# EAGLE design placa_v22 (EAGLE 6.2)
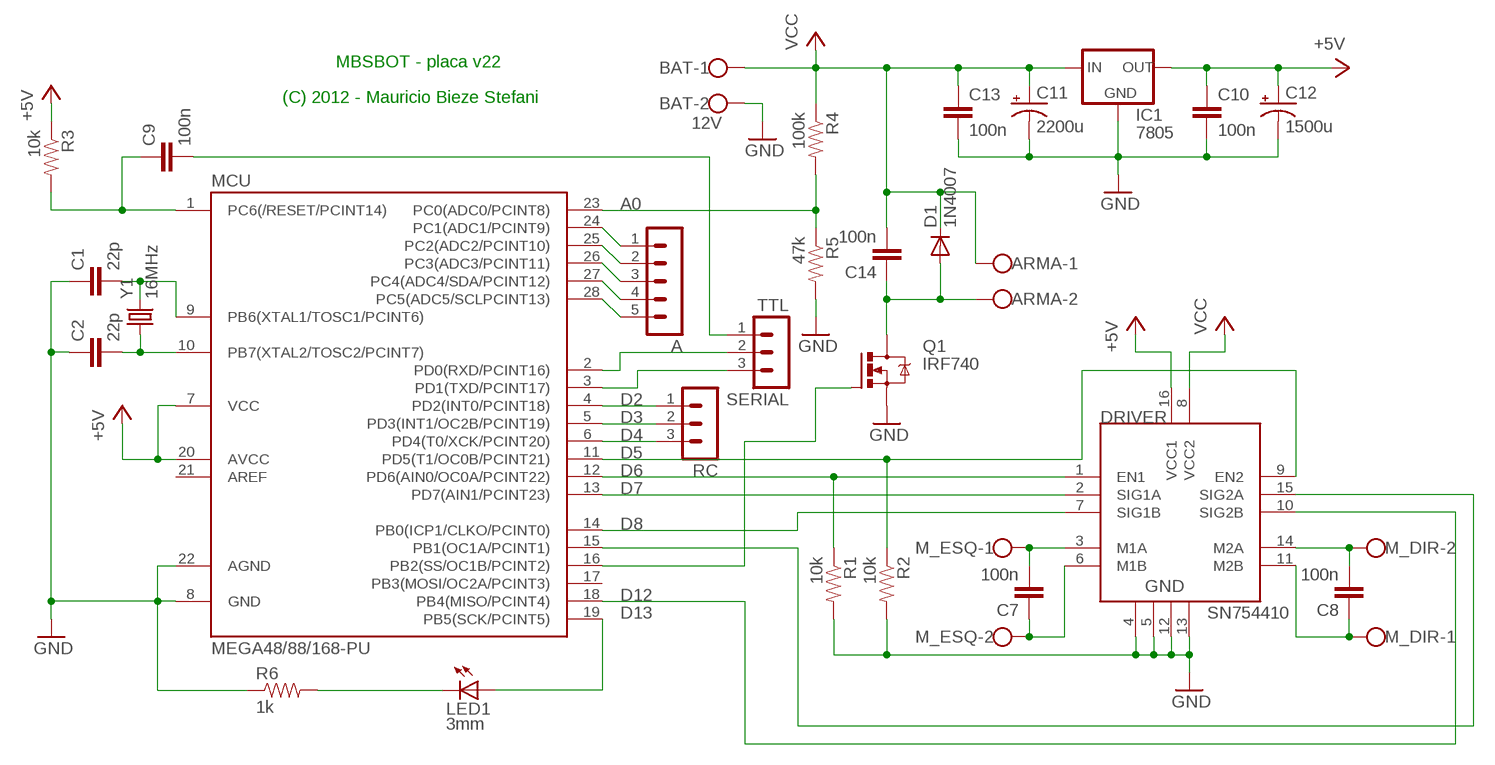
[diagram p0: schematic, sheet 1]

## Parts
A  MA05-1  [MA05-1]
ARMA  W237-102  [W237-102]
BAT  12V  W237-102  [W237-102]
C1  22p  CAPKIT  [CAP-PTH-SMALL-KIT]
C2  22p  CAPKIT  [CAP-PTH-SMALL-KIT]
C7  100n  CAPPTH1  [CAP-PTH-5MM]
C8  100n  CAPPTH1  [CAP-PTH-5MM]
C9  100n  CAPPTH1  [CAP-PTH-5MM]
C10  100n  CAPPTH1  [CAP-PTH-5MM]
C11  2200u  CAP_POLPTH1  [CPOL-RADIAL-100UF-25V]
C12  1500u  CAP_POLPTH1  [CPOL-RADIAL-100UF-25V]
C13  100n  CAPPTH1  [CAP-PTH-5MM]
C14  100n  CAPPTH1  [CAP-PTH-5MM]
D1  1N4007  DIODEPTH  [DIODE-1N4001]
DRIVER  SN754410  [DIP16]
IC1  7805  78XXS  [78XXS]
LED1  3mm  LED3MM  [LED3MM]
M_DIR  W237-102  [W237-102]
M_ESQ  W237-102  [W237-102]
MCU  MEGA48/88/168-PU  [DIL28-3]
Q1  IRF740  [TO220BV]
R1  10k  RESISTORPTH-1/2W  [AXIAL-0.5]
R2  10k  RESISTORPTH-1/2W  [AXIAL-0.5]
R3  10k  RESISTORPTH-1/2W  [AXIAL-0.5]
R4  100k  RESISTORPTH-1/2W  [AXIAL-0.5]
R5  47k  RESISTORPTH-1/2W  [AXIAL-0.5]
R6  1k  RESISTORKIT  [AXIAL-0.3-KIT]
RC  MA03-1  [MA03-1]
SERIAL  TTL  MA03-1  [MA03-1]
Y1  16MHz  CRYSTALHC49US  [HC49US]

## Nets
+5V: C10.1 C12.1(+) DRIVER.16(VCC1) IC1.OUT MCU.7(VCC) MCU.20(AVCC) R3.P$1
A: MCU.2(PD0(RXD/PCINT16)) SERIAL.2
A0: MCU.23(PC0(ADC0/PCINT8)) R4.P$2 R5.P$1
D2: MCU.4(PD2(INT0/PCINT18)) RC.1
D3: MCU.5(PD3(INT1/OC2B/PCINT19)) RC.2
D4: MCU.6(PD4(T0/XCK/PCINT20)) RC.3
D5: DRIVER.9(EN2) MCU.11(PD5(T1/OC0B/PCINT21)) R2.P$1
D6: DRIVER.1(EN1) MCU.12(PD6(AIN0/OC0A/PCINT22)) R1.P$1
D7: DRIVER.2(SIG1A) MCU.13(PD7(AIN1/PCINT23))
D8: DRIVER.7(SIG1B) MCU.14(PB0(ICP1/CLKO/PCINT0))
D12: DRIVER.10(SIG2B) MCU.18(PB4(MISO/PCINT4))
D13: LED1.A MCU.19(PB5(SCK/PCINT5))
GND: BAT.2 C1.1 C2.1 C10.2 C11.2(-) C12.2(-) C13.2 DRIVER.4 DRIVER.5 DRIVER.12 DRIVER.13 IC1.GND MCU.8(GND) MCU.22(AGND) Q1.S R1.P$2 R2.P$2 R5.P$2 R6.P$1
N$1: LED1.K(C) R6.P$2
N$2: C9.1 MCU.1(PC6(/RESET/PCINT14)) R3.P$2
N$3: C1.2 MCU.9(PB6(XTAL1/TOSC1/PCINT6)) Y1.2
N$4: C2.2 MCU.10(PB7(XTAL2/TOSC2/PCINT7)) Y1.1
N$5: C7.2 DRIVER.3(M1A) M_ESQ.1
N$6: C7.1 DRIVER.6(M1B) M_ESQ.2
N$7: C8.1 DRIVER.11(M2B) M_DIR.1
N$8: C8.2 DRIVER.14(M2A) M_DIR.2
N$9: MCU.3(PD1(TXD/PCINT17)) SERIAL.3
N$10: C9.2 SERIAL.1
N$11: ARMA.2 C14.1 D1.A Q1.D
N$12: A.1 MCU.24(PC1(ADC1/PCINT9))
N$13: A.2 MCU.25(PC2(ADC2/PCINT10))
N$14: A.3 MCU.26(PC3(ADC3/PCINT11))
N$15: A.4 MCU.27(PC4(ADC4/SDA/PCINT12))
N$16: A.5 MCU.28(PC5(ADC5/SCLPCINT13))
N$17: MCU.16(PB2(SS/OC1B/PCINT2)) Q1.G
N$19: DRIVER.15(SIG2A) MCU.15(PB1(OC1A/PCINT1))
VCC: ARMA.1 BAT.1 C11.1(+) C13.1 C14.2 D1.C DRIVER.8(VCC2) IC1.IN R4.P$1
Unconnected: MCU.17(PB3(MOSI/OC2A/PCINT3)) MCU.21(AREF)

## Notes on the sheet
- MBSBOT - placa v22
- (C) 2012 - Mauricio Bieze Stefani

## Library data of the parts
A = con-lstb:MA05-1: PIN HEADER; OC_FARNELL: unknown; OC_NEWARK: unknown
ARMA BAT M_DIR M_ESQ = con-wago-500:W237-102: WAGO SCREW CLAMP; MPN: 237-102; OC_FARNELL: unknown; OC_NEWARK: 70K9898
C1 C2 C7-C10 C13 C14 = SparkFun:CAP: Capacitor Standard 0603 ceramic capacitor, and 0.1" leaded capacitor.
C11 C12 = SparkFun:CAP_POL: Capacitor Polarized These are standard SMD and PTH capacitors. Normally 10uF, 47uF, and 100uF in electrolytic and tantalum varieties. Always verify the external diameter of the through hole cap, it varies with capacity, voltage, and manufacturer. The EIA devices should be standard.
D1 = SparkFun:DIODE: Diode These are standard reverse protection diodes and small signal diodes. SMA package can handle up to about 1A. SOD-323 can handle about 200mA. What the SOD-323 package when ordering, there are some mfgs out there that are 5-pin packages.
DRIVER = HBridge:SN754410: Quadruple half-H driver
IC1 = v-reg:78XXS: VOLTAGE REGULATOR
LED1 = SparkFun:LED: LEDs Standard schematic elements and footprints for 5mm, 3mm, 1206, and 0603 sized LEDs. 5mm - Spark Fun Electronics SKU : COM-00529 (and others)
MCU = avr-7:MEGA48/88/168-PU
Q1 = transistor-power:IRF740: N-CHANNEL MOS FET
R1-R6 = SparkFun:RESISTOR: Resistor Basic schematic elements and footprints for 0603, 1206, and PTH resistors.
RC SERIAL = con-lstb:MA03-1: PIN HEADER; OC_FARNELL: unknown; OC_NEWARK: unknown
Y1 = SparkFun:CRYSTAL: Crystals Various standard crystals. Proven footprints. Spark Fun Electronics SKU : COM-00534

## Board
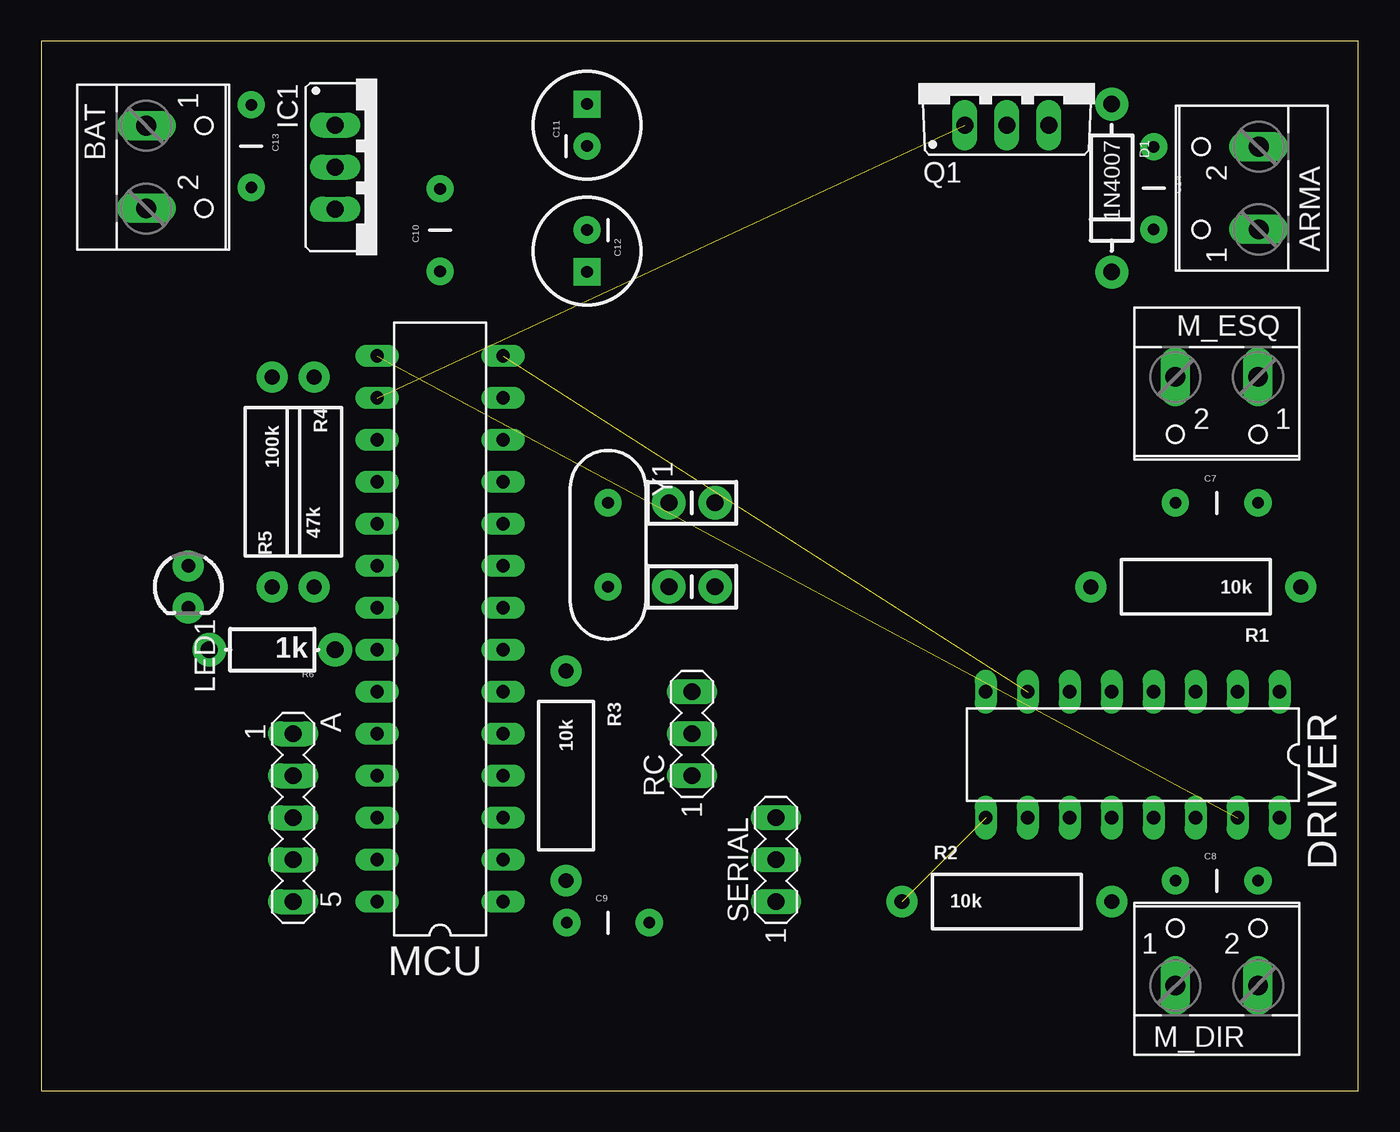
[diagram p1: board, top side]
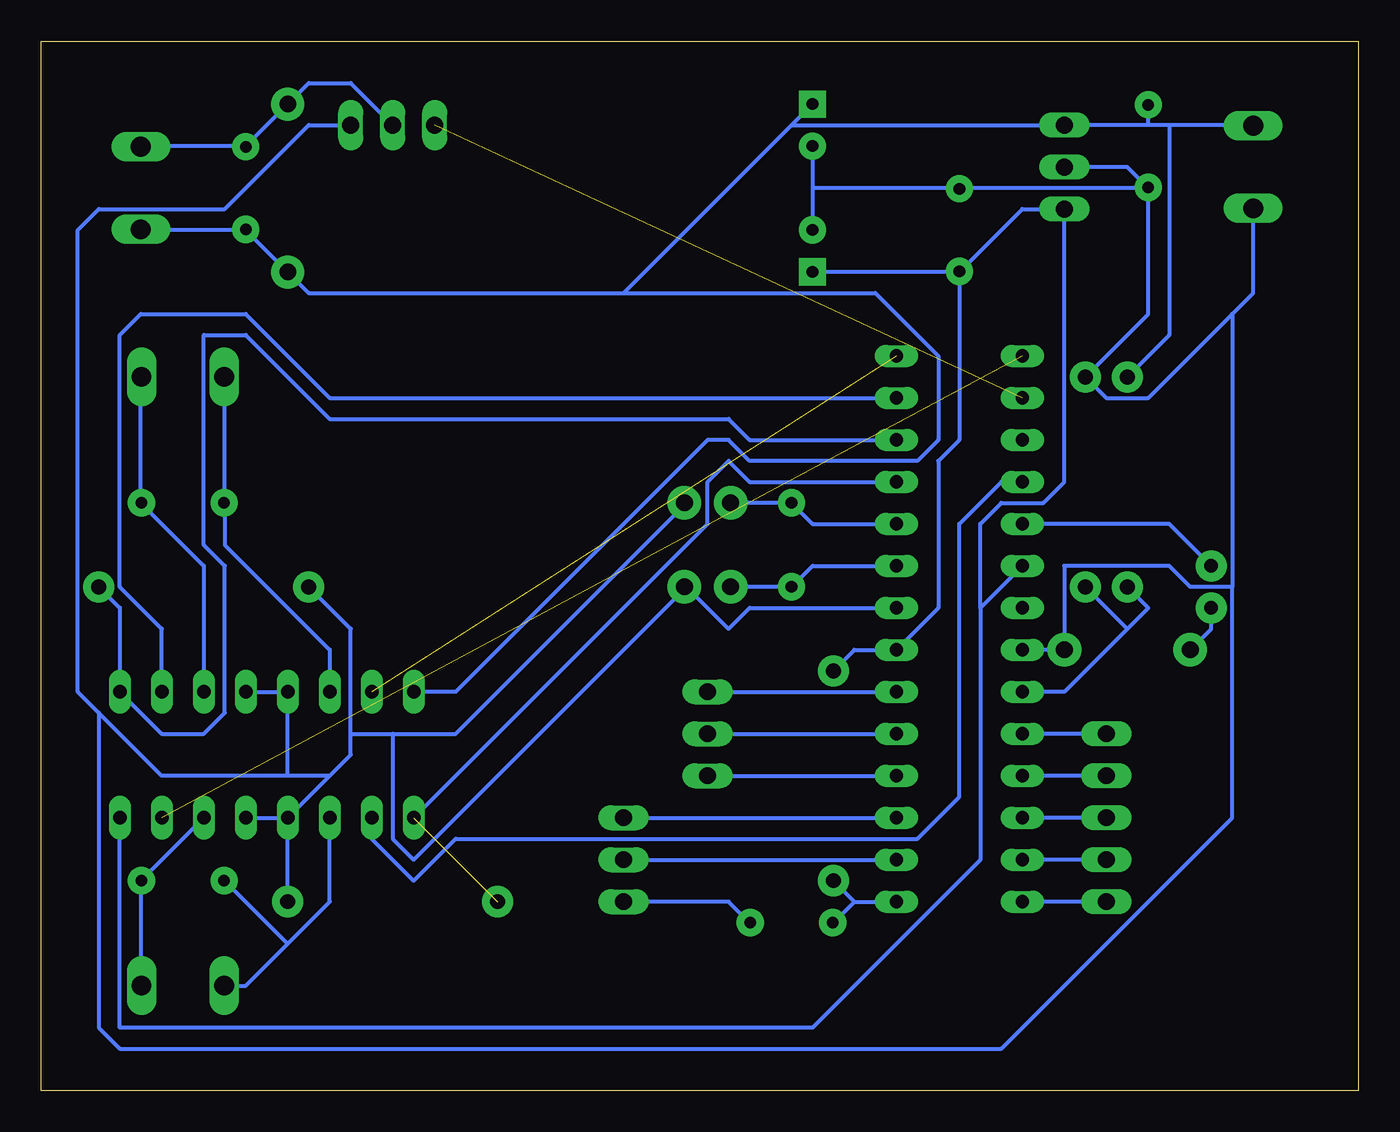
[diagram p2: board, bottom side, seen from below]

Size 79.68 x 63.49 mm. Coordinates in mm from the lower left corner, seen from the top.
Outline: 0,0 79.68,0 79.68,63.49 0,63.49 0,0
Copper layers (1*16): Top 0.035mm / dielectric 1.5mm / Bottom 0.035mm
Design rules: minimum track width 10mil, minimum drill 24mil, track to track 8mil, track to pad 8mil, pad to pad 8mil, via to via 8mil, smd to smd 8mil, copper to edge 40mil, drill to drill 8mil, minimum pad ring 10mil, minimum via ring 8mil, stop-mask expansion 4mil, vias tented up to drill 0mil, thermal gap 10mil

### Footprints (pad centres in the part's own frame; a part is rotated, then mirrored left to right if it is on the bottom)
MA05-1 = drill 1.016 long: 1 -5.08,0; 2 -2.54,0; 3 0,0; 4 2.54,0; 5 5.08,0
W237-102 = drill 1.194 long: 1 -2.5,-1.27; 2 2.5,-1.27
CAP-PTH-SMALL-KIT = drill 1.016 pad 2.032: 1 -1.397,0; 2 1.397,0
CAP-PTH-5MM = drill 0.7 pad 1.651: 1 -2.5,0; 2 2.5,0
CPOL-RADIAL-100UF-25V = drill 0.7 pad 1.651 square: 1 1.27,0 | drill 0.7 pad 1.651: 2 -1.27,0
DIODE-1N4001 = drill 1 pad 1.981: A -5.08,0; C 5.08,0
DIP16 = drill 0.813 long: 1 -10.16,-3.81; 2 -7.62,-3.81; 3 -5.08,-3.81; 4 -2.54,-3.81; 5 0,-3.81; 6 2.54,-3.81; 7 5.08,-3.81; 8 7.62,-3.81; 9 7.62,3.81; 10 5.08,3.81; 11 2.54,3.81; 12 0,3.81; 13 -2.54,3.81; 14 -5.08,3.81; 15 -7.62,3.81; 16 -10.16,3.81
78XXS = drill 1.016 long: GND 0,-2.54; IN -2.54,-2.54; OUT 2.54,-2.54
LED3MM = drill 0.813 pad 1.88: A -1.27,0; K 1.27,0
DIL28-3 = drill 0.813 long: 1 -16.51,-3.81; 2 -13.97,-3.81; 3 -11.43,-3.81; 4 -8.89,-3.81; 5 -6.35,-3.81; 6 -3.81,-3.81; 7 -1.27,-3.81; 8 1.27,-3.81; 9 3.81,-3.81; 10 6.35,-3.81; 11 8.89,-3.81; 12 11.43,-3.81; 13 13.97,-3.81; 14 16.51,-3.81; 15 16.51,3.81; 16 13.97,3.81; 17 11.43,3.81; 18 8.89,3.81; 19 6.35,3.81; 20 3.81,3.81; 21 1.27,3.81; 22 -1.27,3.81; 23 -3.81,3.81; 24 -6.35,3.81; 25 -8.89,3.81; 26 -11.43,3.81; 27 -13.97,3.81; 28 -16.51,3.81
TO220BV = drill 1.016 long: D 0,-2.54; G -2.54,-2.54; S 2.54,-2.54
AXIAL-0.5 = drill 0.9 pad 1.88: P$1 -6.35,0; P$2 6.35,0
AXIAL-0.3-KIT = drill 1.016 pad 2.032: P$1 -3.81,0; P$2 3.81,0
MA03-1 = drill 1.016 long: 1 -2.54,0; 2 0,0; 3 2.54,0
HC49US = drill 0.7 pad 1.651: 1 -2.54,0; 2 2.54,0

### Placement (x,y rotation side)
A  15.24,16.51 270 top
ARMA  72.39,54.61 90 top
BAT  7.62,55.88 270 top
C1  39.37,30.48 180 top
C2  39.37,35.56 180 top
C7  71.12,35.56 0 top
C8  71.12,12.7 0 top
C9  34.29,10.16 0 top
C10  24.13,52.07 90 top
C11  33.02,58.42 90 top
C12  33.02,50.8 270 top
C13  12.7,57.15 270 top
C14  67.31,54.61 270 top
D1  64.77,54.61 270 top
DRIVER  64.77,20.32 180 top
IC1  20.32,55.88 270 top
LED1  8.89,30.48 270 top
M_DIR  71.12,7.62 0 top
M_ESQ  71.12,41.91 180 top
MCU  24.13,27.94 90 top
Q1  58.42,60.96 0 top
R1  69.85,30.48 180 top
R2  58.42,11.43 0 top
R3  31.75,19.05 270 top
R4  13.97,36.83 270 top
R5  16.51,36.83 90 top
R6  13.97,26.67 180 top
RC  39.37,21.59 90 top
SERIAL  44.45,13.97 90 top
Y1  34.29,33.02 270 top

### Tracks (layer width: path | path; a pad name or v marks a point on that pad's centre or on a via)
+5V
  Bottom 0.254: R3.P$1 30.48,26.67 MCU.7 25.4,29.21 25.4,38.1 24.13,39.37 24.13,49.53 | 24.13,49.53 20.32,53.34 IC1.OUT 17.78,36.83 19.05,35.56 21.59,35.56 22.86,34.29 22.86,29.21 | 24.13,49.53 C12.1 | 24.13,49.53 C10.1 | DRIVER.16 74.93,3.81 33.02,3.81 22.86,13.97 22.86,29.21 | MCU.20 22.86,29.21
A
  Bottom 0.254: SERIAL.2 MCU.2
A0
  Bottom 0.254: MCU.23 17.78,24.13 13.97,27.94 | 13.97,27.94 12.7,29.21 R4.P$2 | 13.97,27.94 R5.P$1
D2
  Bottom 0.254: RC.1 MCU.4
D3
  Bottom 0.254: RC.2 MCU.5
D4
  Bottom 0.254: RC.3 MCU.6
D5  (1 unrouted)
  Bottom 0.254: MCU.11 36.83,36.83 38.1,38.1 39.37,36.83 39.37,34.29 DRIVER.9
D6
  Bottom 0.254: R1.P$1 74.93,29.21 DRIVER.1 72.39,21.59 69.85,21.59 68.58,22.86 68.58,31.75 69.85,33.02 69.85,45.72 67.31,45.72 62.23,40.64 38.1,40.64 36.83,39.37 MCU.12
D7
  Bottom 0.254: MCU.13 62.23,41.91 67.31,46.99 73.66,46.99 74.93,45.72 74.93,30.48 72.39,27.94 DRIVER.2
D8  (1 unrouted)
D12
  Bottom 0.254: MCU.18 21.59,36.83 24.13,34.29 24.13,17.78 26.67,15.24 54.61,15.24 57.15,12.7 59.69,15.24 DRIVER.10
D13
  Bottom 0.254: MCU.19 11.43,34.29 LED1.A
GND
  Bottom 0.254: DRIVER.4 DRIVER.5 64.77,19.05 | DRIVER.13 DRIVER.12 | R2.P$2 DRIVER.12 | R1.P$2 60.96,27.94 60.96,21.59 | 60.96,21.59 60.96,20.32 62.23,19.05 | DRIVER.12 62.23,19.05 | MCU.22 R6.P$1 17.78,31.75 11.43,31.75 10.16,30.48 7.62,30.48 | C11.2 33.02,54.61 | 33.02,54.61 C12.2 | IC1.GND 13.97,55.88 12.7,54.61 | 12.7,54.61 24.13,54.61 | 24.13,54.61 33.02,54.61 | 24.13,54.61 C10.2 | BAT.2 6.35,48.26 7.62,46.99 | 7.62,46.99 12.7,41.91 15.24,41.91 R5.P$2 12.7,46.99 12.7,54.61 | 7.62,46.99 7.62,30.48 | 12.7,54.61 C13.2 | MCU.8 36.83,29.21 38.1,27.94 40.64,30.48 | Q1.S 63.5,58.42 68.58,53.34 76.2,53.34 77.47,52.07 77.47,24.13 76.2,22.86 | 76.2,22.86 72.39,19.05 64.77,19.05 | 62.23,19.05 64.77,19.05 | 60.96,21.59 58.42,21.59 | 58.42,21.59 54.61,21.59 40.64,35.56 C2.1 | 40.64,30.48 57.15,13.97 58.42,15.24 58.42,21.59 | 40.64,30.48 C1.1 | 7.62,30.48 7.62,16.51 21.59,2.54 74.93,2.54 76.2,3.81 76.2,22.86
N$1
  Bottom 0.254: LED1.K 8.89,27.94 R6.P$2
N$2
  Bottom 0.254: 30.48,11.43 MCU.1 | R3.P$2 30.48,11.43 | 30.48,11.43 31.75,10.16 C9.1
N$3
  Bottom 0.254: MCU.9 33.02,31.75 Y1.2 C1.2 38.1,30.48
N$4
  Bottom 0.254: MCU.10 33.02,34.29 Y1.1 C2.2 38.1,35.56
N$5
  Bottom 0.254: DRIVER.3 69.85,31.75 73.66,35.56 | 73.66,35.56 73.66,43.18 M_ESQ.1 | 73.66,35.56 C7.2
N$6
  Bottom 0.254: 68.58,35.56 68.58,33.02 62.23,26.67 DRIVER.6 | 68.58,35.56 68.58,43.18 M_ESQ.2 | 68.58,35.56 C7.1
N$7
  Bottom 0.254: DRIVER.11 62.23,11.43 64.77,8.89 | 64.77,8.89 67.31,6.35 M_DIR.1 | 64.77,8.89 68.58,12.7 C8.1
N$8
  Bottom 0.254: 73.66,12.7 DRIVER.14 | 73.66,12.7 73.66,6.35 M_DIR.2 | 73.66,12.7 C8.2
N$9
  Bottom 0.254: SERIAL.3 MCU.3
N$10
  Bottom 0.254: SERIAL.1 38.1,11.43 36.83,10.16 C9.2
N$11
  Bottom 0.254: Q1.D 60.96,60.96 63.5,60.96 D1.A 67.31,57.15 | 67.31,57.15 73.66,57.15 ARMA.2 | 67.31,57.15 C14.1
N$12
  Bottom 0.254: A.1 MCU.24
N$13
  Bottom 0.254: A.2 MCU.25
N$14
  Bottom 0.254: A.3 MCU.26
N$15
  Bottom 0.254: A.4 MCU.27
N$16
  Bottom 0.254: A.5 MCU.28
N$17  (1 unrouted)
N$19  (1 unrouted)
VCC
  Bottom 0.254: 11.43,58.42 6.35,58.42 BAT.1 | 11.43,58.42 12.7,58.42 | 12.7,58.42 IC1.IN 34.29,58.42 | 12.7,58.42 C13.1 12.7,59.69 | R4.P$1 11.43,45.72 11.43,58.42 | DRIVER.8 54.61,24.13 39.37,39.37 38.1,39.37 36.83,38.1 26.67,38.1 25.4,39.37 25.4,44.45 29.21,48.26 44.45,48.26 | 44.45,48.26 63.5,48.26 D1.C 67.31,52.07 | 44.45,48.26 34.29,58.42 | 34.29,58.42 C11.1 | 67.31,52.07 73.66,52.07 ARMA.1 | 67.31,52.07 C14.2